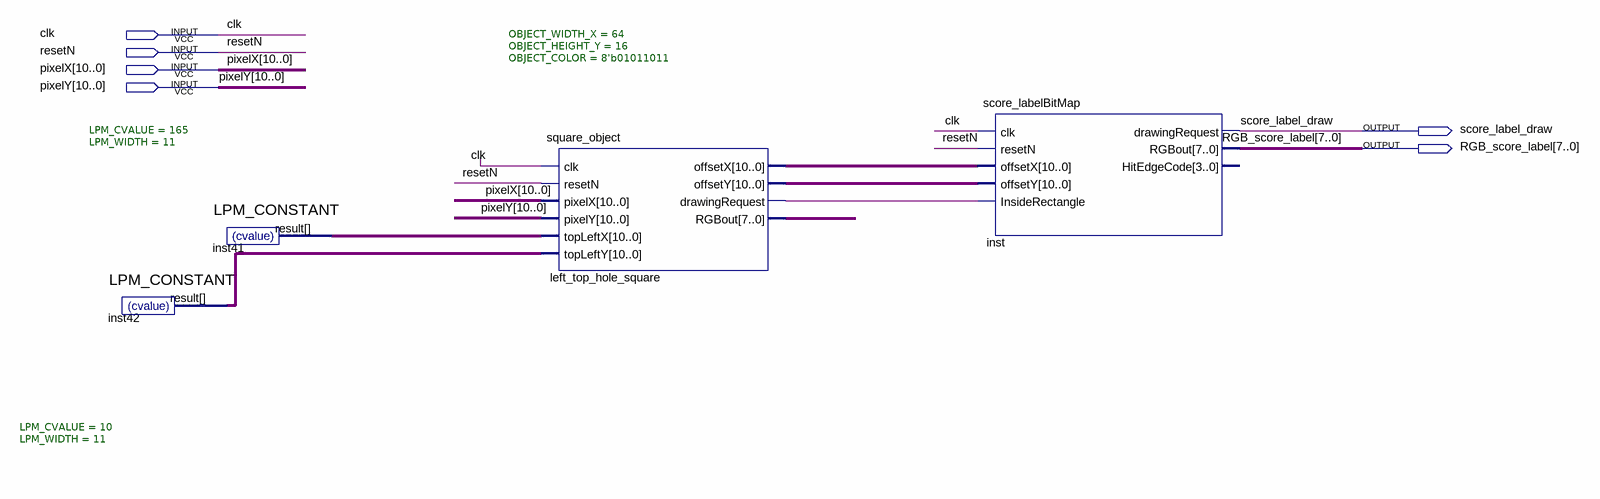
[diagram p0: schematic sheet]
// Quartus schematic score_label.bdf as structural Verilog: 4 symbols, 6 pins
module score_label (
  input  clk,
  input  resetN,
  input  [10:0] pixelX,
  input  [10:0] pixelY,
  output score_label_draw,
  output [7:0] RGB_score_label
);

  wire left_top_hole_square_drawingrequest;
  wire [7:0] left_top_hole_square_rgbout;
  wire [10:0] inst41_result, inst42_result, left_top_hole_square_offsetx, left_top_hole_square_offsety;

  LPM_CONSTANT #(.LPM_CVALUE(10), .LPM_WIDTH(11)) inst42 (.result(inst42_result));
  LPM_CONSTANT #(.LPM_CVALUE(165), .LPM_WIDTH(11)) inst41 (.result(inst41_result));
  square_object #(.OBJECT_WIDTH_X(64), .OBJECT_HEIGHT_Y(16), .OBJECT_COLOR(8'b01011011)) left_top_hole_square (
    .clk(clk), .resetN(resetN), .pixelX(pixelX), .pixelY(pixelY), .topLeftX(inst41_result),
    .topLeftY(inst42_result), .offsetX(left_top_hole_square_offsetx), .offsetY(left_top_hole_square_offsety),
    .drawingRequest(left_top_hole_square_drawingrequest), .RGBout(left_top_hole_square_rgbout));
  score_labelBitMap inst (
    .clk(clk), .resetN(resetN), .offsetX(left_top_hole_square_offsetx),
    .offsetY(left_top_hole_square_offsety), .InsideRectangle(left_top_hole_square_drawingrequest),
    .drawingRequest(score_label_draw), .RGBout(RGB_score_label));  // open: HitEdgeCode
endmodule
